# Altium schematic sheet RS232.SchDoc
size A4; SheetNumber: 6; SheetTotal: 6
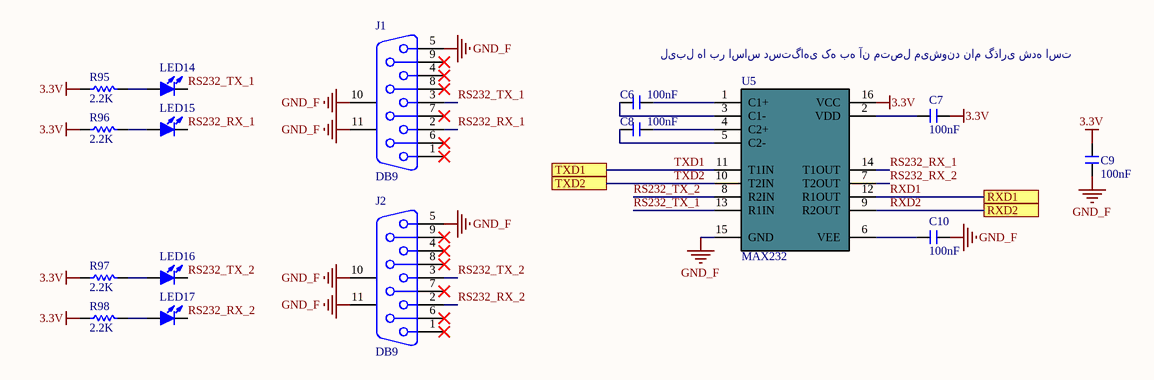
[diagram p0: RS232.SchDoc]

## Parts
C6  100nF  [C 0805]
C7  100nF  [C 0805]
C8  100nF  [C 0805]
C9  100nF  [C 0805]
C10  100nF  [C 0805]
J1  DB9  [DB9/S_A]
J2  DB9  [DB9/S_A]
LED14  LED-SMD  [LED 0805Y]  (value not drawn)
LED15  LED-SMD  [LED 0805Y]  (value not drawn)
LED16  LED-SMD  [LED 0805Y]  (value not drawn)
LED17  LED-SMD  [LED 0805Y]  (value not drawn)
R95  2.2K  [R 0805]
R96  2.2K  [R 0805]
R97  2.2K  [R 0805]
R98  2.2K  [R 0805]
U5  MAX232  [SOP16_N]

## Ports
RXD1, RXD2, TXD1, TXD2

## Nets
3.3V: C7.2 C9.1 R95.1 R96.1 R97.1 R98.1 U5.16(VCC)
GND_F: C9.2 C10.2 J1.5 J1.10(MH1) J1.11(MH2) J2.5 J2.10(MH1) J2.11(MH2) U5.15(GND)
RS232_RX_1: J1.2 LED15.2(K) U5.14(T1OUT)
RS232_RX_2: J2.2 LED17.2(K) U5.7(T2OUT)
RS232_TX_1: J1.3 LED14.2(K) U5.13(R1IN)
RS232_TX_2: J2.3 LED16.2(K) U5.8(R2IN)
RXD1: U5.12(R1OUT) ; port RXD1
RXD2: U5.9(R2OUT) ; port RXD2
TXD1: U5.11(T1IN) ; port TXD1
TXD2: U5.10(T2IN) ; port TXD2
NetC6_1: C6.1 U5.3(C1-)
NetC6_2: C6.2 U5.1(C1+)
NetC7_1: C7.1 U5.2(VDD)
NetC8_1: C8.1 U5.4(C2+)
NetC8_2: C8.2 U5.5(C2-)
NetC10_1: C10.1 U5.6(VEE)
NetLED14_1: LED14.1(A) R95.2
NetLED15_1: LED15.1(A) R96.2
NetLED16_1: LED16.1(A) R97.2
NetLED17_1: LED17.1(A) R98.2

Not connected (* = marked no-connect by the designer): J1 1* 4* 6* 7* 8* 9*; J2 1* 4* 6* 7* 8* 9*

## Notes on the sheet
- لیبل ها بر اساس دستگاهی که به آن متصل میشوند نام گذاری شده است

## Library data of the parts
C6-C10 = C: Non-polar patch capacitor; BOM名称: 无极性贴片电容; 版权归属: 源创客; 学习资源: www.ooocke.com
J1 J2 = DB9: 9-pin serial port; BOM名称: 9针串口; 版权归属: 源创客; 学习资源: www.ooocke.com
LED14-LED17 = LED-SMD: Patch LED; BOM名称: 贴片LED; 版权归属: 源创客; 学习资源: www.ooocke.com
R95-R98 = R: Chip resistor; 版权归属: 源创客; BOM名称: Chip resistor; 学习资源: www.ooocke.com
U5 = MAX232: RS432 to USB; 版权归属: 源创客; BOM名称: MAX232; 学习资源: www.ooocke.com